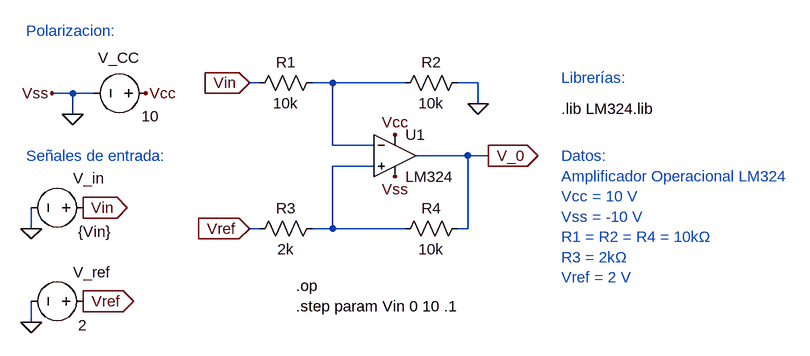
[diagram p0: schematic Lab_1_Circ_4.asc]
Lab_1_Circ_4.asc, the LTspice schematic file:
Version 4
SHEET 1 1560 680
WIRE 608 -288 592 -288
WIRE 720 -288 688 -288
WIRE 832 -288 720 -288
WIRE 944 -288 912 -288
WIRE 320 -272 288 -272
WIRE 352 -272 320 -272
WIRE 944 -256 944 -288
WIRE 320 -240 320 -272
WIRE 720 -192 720 -288
WIRE 784 -192 720 -192
WIRE 928 -176 848 -176
WIRE 960 -176 928 -176
WIRE 784 -160 720 -160
WIRE 256 -64 256 -96
WIRE 608 -64 592 -64
WIRE 720 -64 720 -160
WIRE 720 -64 688 -64
WIRE 832 -64 720 -64
WIRE 928 -64 928 -176
WIRE 928 -64 912 -64
WIRE 256 80 256 48
FLAG 944 -256 0
FLAG 432 -272 Vcc
FLAG 816 -208 Vcc
FLAG 288 -272 Vss
FLAG 816 -144 Vss
FLAG 320 -240 0
FLAG 256 -64 0
FLAG 592 -64 Vref
IOPIN 592 -64 In
FLAG 336 -96 Vin
IOPIN 336 -96 Out
FLAG 960 -176 V_0
IOPIN 960 -176 Out
FLAG 592 -288 Vin
IOPIN 592 -288 In
FLAG 256 80 0
FLAG 336 48 Vref
IOPIN 336 48 Out
SYMBOL OpAmps\\opamp2 816 -240 R0
SYMATTR InstName U1
SYMATTR Value LM324
SYMBOL res 592 -272 R270
WINDOW 0 32 56 VTop 2
WINDOW 3 0 56 VBottom 2
SYMATTR InstName R1
SYMATTR Value 10k
SYMBOL res 816 -272 R270
WINDOW 0 32 56 VTop 2
WINDOW 3 0 56 VBottom 2
SYMATTR InstName R2
SYMATTR Value 10k
SYMBOL res 592 -48 R270
WINDOW 0 32 56 VTop 2
WINDOW 3 0 56 VBottom 2
SYMATTR InstName R3
SYMATTR Value 2k
SYMBOL res 816 -48 R270
WINDOW 0 32 56 VTop 2
WINDOW 3 0 56 VBottom 2
SYMATTR InstName R4
SYMATTR Value 10k
SYMBOL voltage 352 -96 M270
WINDOW 0 45 31 VLeft 2
WINDOW 3 -37 24 VLeft 2
WINDOW 123 0 0 Left 0
WINDOW 39 0 0 Left 0
SYMATTR InstName V_in
SYMATTR Value {Vin}
SYMBOL voltage 448 -272 R90
WINDOW 0 -55 25 VRight 2
WINDOW 3 35 -5 VRight 2
WINDOW 123 0 0 Left 0
WINDOW 39 0 0 Left 0
SYMATTR InstName V_CC
SYMATTR Value 10
SYMBOL voltage 352 48 M270
WINDOW 0 45 31 VLeft 2
WINDOW 3 -37 24 VLeft 2
WINDOW 123 0 0 Left 0
WINDOW 39 0 0 Left 0
SYMATTR InstName V_ref
SYMATTR Value 2
TEXT 1072 -248 Left 2 !.lib LM324.lib
TEXT 1072 -296 Left 2 ;Librerías:
TEXT 248 -368 Left 2 ;Polarizacion:
TEXT 248 -176 Left 2 ;Señales de entrada:
TEXT 1072 -176 Left 2 ;Datos:\nAmplificador Operacional LM324\nVcc = 10 V\nVss = -10 V\nR1 = R2 = R4 = 10kΩ\nR3 = 2kΩ\nVref = 2 V
TEXT 664 24 Left 2 !.op\n.step param Vin 0 10 .1

The netlist it stands for:
* Lab_1_Circ_4.asc
XU1 N002 N001 Vcc 0 V_0 LM324  ; pins In+ In- V+ V- OUT
R1 Vin N001 10k
R2 N001 0 10k
R3 Vref N002 2k
R4 N002 V_0 10k
V_in Vin 0 {Vin}
V_CC Vcc 0 10
V_ref Vref 0 2
.lib LM324.lib
* Librerías:
* Polarizacion:
* Señales de entrada:
* Datos:
* Amplificador Operacional LM324
* Vcc = 10 V
* Vss = -10 V
* R1 = R2 = R4 = 10kΩ
* R3 = 2kΩ
* Vref = 2 V
.op
.step param Vin 0 10 .1
.backanno
.end

* Results of the author's LTspice run, read from the files saved beside the schematic
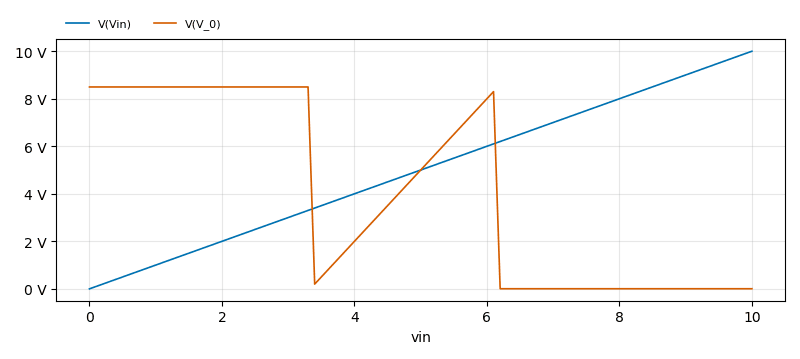
[diagram p1: Operating Point of Lab_1_Circ_4.asc, plotted from the saved traces]
* Operating Point, 1 run:
*   V(Vin): 0 V at vin=0, 10 V at vin=10 , min 0 V, max 10 V
*   V(V_0): 8.496 V at vin=0, 4.296 mV at vin=10 , min 4.296 mV, max 8.496 V
* From the log:
*   Semiconductor Device Operating Points:
*                           --- Diodes ---
*   Name:    d:u1:p      d:u1:ln     d:u1:lp     d:u1:e      d:u1:c
*   Model:    u1:dx       u1:dx       u1:dx       u1:dx       u1:dx
*   Id:     -1.00e-11   -4.06e-11   -3.95e-11   -7.90e-12    8.15e-06
*   Vd:     -1.00e+01   -4.05e+01   -3.95e+01   -7.90e+00    5.96e-01
*   Req:     1.00e+12    1.00e+12    1.00e+12    1.00e+12    3.17e+03
*   CAP:     0.00e+00    0.00e+00    0.00e+00    0.00e+00    0.00e+00
*                           --- Bipolar Transistors ---
*   Name:     q:u1:2      q:u1:1
*   Model:     u1:qx       u1:qx
*   Ib:       5.54e-12   -4.09e-08
*   Ic:      -3.08e-12   -1.02e-05
*   Vbe:      2.45e+00   -6.02e-01
*   Vbc:      3.08e+00   -8.11e-02
*   Vce:     -6.31e-01   -5.21e-01
*   BetaDC:  -5.57e-01    2.50e+02
*   Gm:       2.08e-55    3.95e-04
*   Rpi:      1.00e+12    6.33e+05
*   Rx:       0.00e+00    0.00e+00
*   Ro:       1.86e+65    1.41e+12
*   Cbe:      0.00e+00    0.00e+00
*   Cbc:      0.00e+00    0.00e+00
*   Cjs:      0.00e+00    0.00e+00
*   BetaAC:   2.08e-43    2.50e+02
*   Cbx:      0.00e+00    0.00e+00
*   Ft:       0.00e+00    0.00e+00